# Altium schematic sheet 5_6165557048126742241.SchDoc
size A; SheetNumber: 1; SheetTotal: 1
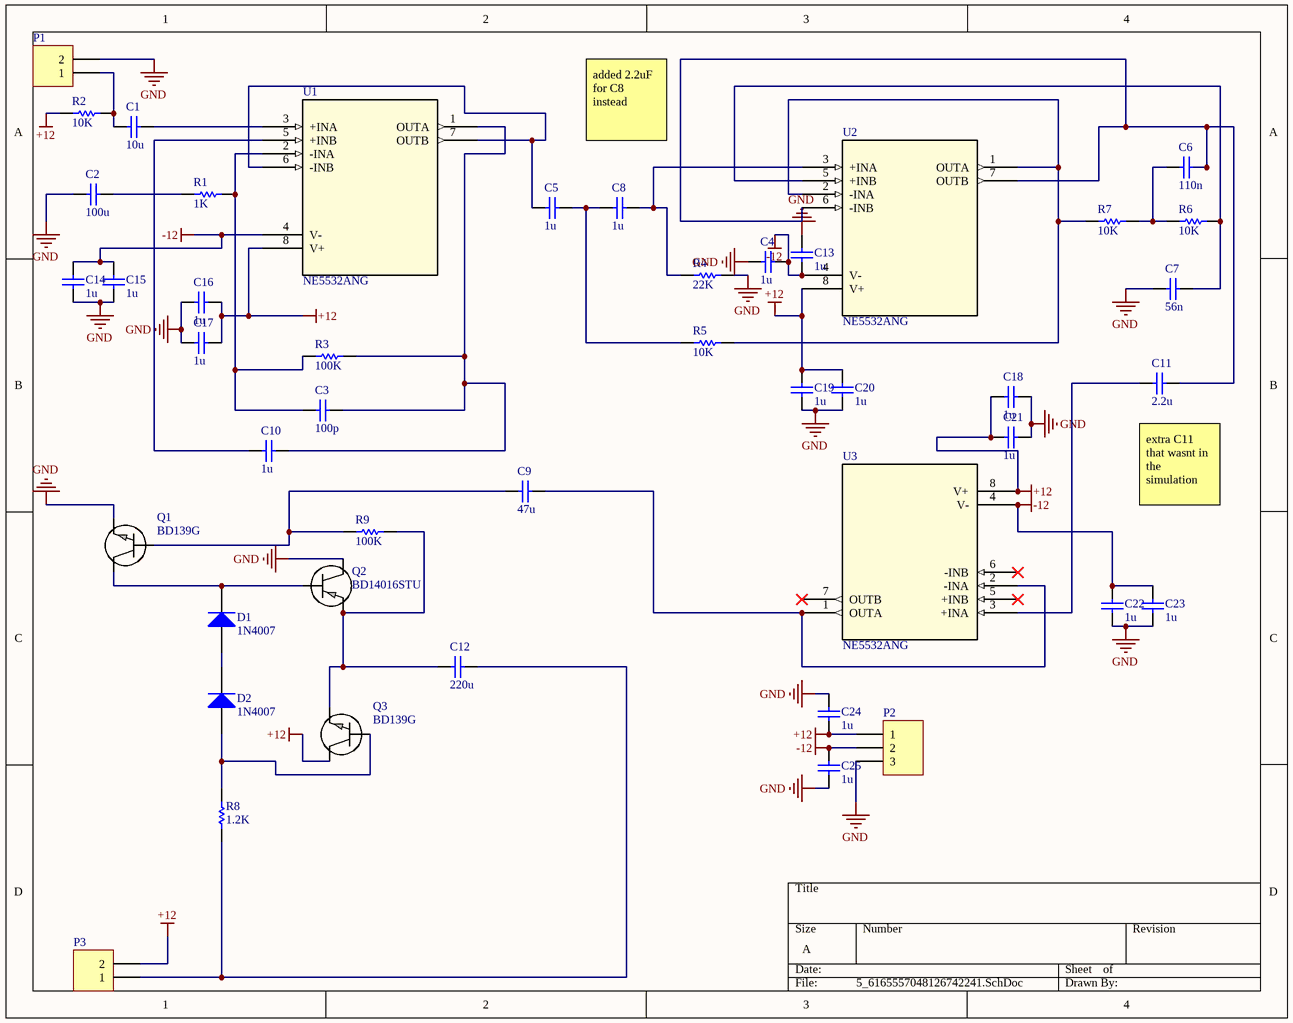
[diagram p0: 5_6165557048126742241.SchDoc]

## Parts
C1  value 10u  [CAP_RDE5C1H104J2K1H03B]  (hidden comment: Capacitor)
C2  value 100u  [CAP_RDE5C1H104J2K1H03B]  (hidden comment: Capacitor)
C3  value 100p  [CAP_RDE5C1H104J2K1H03B]  (hidden comment: Capacitor)
C4  value 1u  [CAP_RDE5C1H104J2K1H03B]  (hidden comment: Capacitor)
C5  value 1u  [CAP_RDE5C1H104J2K1H03B]  (hidden comment: Capacitor)
C6  value 110n  [CAP_RDE5C1H104J2K1H03B]  (hidden comment: Capacitor)
C7  value 56n  [CAP_RDE5C1H104J2K1H03B]  (hidden comment: Capacitor)
C8  value 1u  [CAP_RDE5C1H104J2K1H03B]  (hidden comment: Capacitor)
C9  value 47u  [CAP_RDE5C1H104J2K1H03B]  (hidden comment: Capacitor)
C10  value 1u  [CAP_RDE5C1H104J2K1H03B]  (hidden comment: Capacitor)
C11  value 2.2u  [CAP_RDE5C1H104J2K1H03B]  (hidden comment: Capacitor)
C12  value 220u  [CAP_RDE5C1H104J2K1H03B]  (hidden comment: Capacitor)
C13  value 1u  [CAP_RDE5C1H104J2K1H03B]  (hidden comment: Capacitor)
C14  value 1u  [CAP_RDE5C1H104J2K1H03B]  (hidden comment: Capacitor)
C15  value 1u  [CAP_RDE5C1H104J2K1H03B]  (hidden comment: Capacitor)
C16  value 1u  [CAP_RDE5C1H104J2K1H03B]  (hidden comment: Capacitor)
C17  value 1u  [CAP_RDE5C1H104J2K1H03B]  (hidden comment: Capacitor)
C18  value 1u  [CAP_RDE5C1H104J2K1H03B]  (hidden comment: Capacitor)
C19  value 1u  [CAP_RDE5C1H104J2K1H03B]  (hidden comment: Capacitor)
C20  value 1u  [CAP_RDE5C1H104J2K1H03B]  (hidden comment: Capacitor)
C21  value 1u  [CAP_RDE5C1H104J2K1H03B]  (hidden comment: Capacitor)
C22  value 1u  [CAP_RDE5C1H104J2K1H03B]  (hidden comment: Capacitor)
C23  value 1u  [CAP_RDE5C1H104J2K1H03B]  (hidden comment: Capacitor)
C24  value 1u  [CAP_RDE5C1H104J2K1H03B]  (hidden comment: Capacitor)
C25  value 1u  [CAP_RDE5C1H104J2K1H03B]  (hidden comment: Capacitor)
D1  1N4007  [My_DO41]
D2  1N4007  [My_DO41]
P1  Header 2  [My_1X02]  (value not drawn)
P2  Header 3  [My_CN3]  (value not drawn)
P3  Header 2  [My_1X02]  (value not drawn)
Q1  BD139G  [SOT-32_STM]
Q2  BD14016STU  [SOT-32_STM]
Q3  BD139G  [SOT-32_STM]
R1  value 1K  [RESAD700W45L350D185]  (hidden comment: Resistor)
R2  value 10K  [RESAD700W45L350D185]  (hidden comment: Resistor)
R3  value 100K  [RESAD700W45L350D185]  (hidden comment: Resistor)
R4  value 22K  [RESAD700W45L350D185]  (hidden comment: Resistor)
R5  value 10K  [RESAD700W45L350D185]  (hidden comment: Resistor)
R6  value 10K  [RESAD700W45L350D185]  (hidden comment: Resistor)
R7  value 10K  [RESAD700W45L350D185]  (hidden comment: Resistor)
R8  value 1.2K  [RESAD700W45L350D185]  (hidden comment: Resistor)
R9  value 100K  [RESAD700W45L350D185]  (hidden comment: Resistor)
U1  NE5532ANG  [P8]
U2  NE5532ANG  [P8]
U3  NE5532ANG  [P8]

## Nets
+12: C16.2 C17.2 C18.2 C19.2 C20.2 C21.2 C24.1 P2.1 P3.2 Q3.2(C) R2.1 U1.8(V+) U2.8(V+) U3.8(V+)
-12: C4.1 C13.1 C14.2 C15.2 C22.2 C23.2 C25.2 P2.2 U1.4(V-) U2.4(V-) U3.4(V-)
GND: C2.1 C4.2 C7.1 C13.2 C14.1 C15.1 C16.1 C17.1 C18.1 C19.1 C20.1 C21.1 C22.1 C23.1 C24.2 C25.1 P1.2 P2.3 Q1.1(E) Q2.2(C) R4.2
NetC1_1: C1.1 P1.1 R2.2
NetC1_2: C1.2 U1.3(+INA)
NetC2_2: C2.2 R1.1
NetC3_1: C3.1 R1.2 R3.1 U1.2(-INA)
NetC3_2: C3.2 C10.2 R3.2 U1.1(OUTA)
NetC5_1: C5.1 U1.6(-INB) U1.7(OUTB)
NetC5_2: C5.2 C8.1 R5.1
NetC6_1: C6.1 R6.1 R7.2
NetC6_2: C6.2 C11.2 U2.6(-INB) U2.7(OUTB)
NetC7_2: C7.2 R6.2 U2.5(+INB)
NetC8_2: C8.2 R4.1 U2.3(+INA)
NetC9_1: C9.1 Q1.3(B) R9.1
NetC9_2: C9.2 U3.1(OUTA) U3.2(-INA)
NetC10_1: C10.1 U1.5(+INB)
NetC11_1: C11.1 U3.3(+INA)
NetC12_1: C12.1 Q2.1(E) Q3.1(E) R9.2
NetC12_2: C12.2 P3.1 R8.1
NetD1_A: D1.A D2.K
NetD1_K: D1.K Q1.2(C) Q2.3(B)
NetD2_A: D2.A Q3.3(B) R8.2
NetR5_2: R5.2 R7.1 U2.1(OUTA) U2.2(-INA)

Not connected (* = marked no-connect by the designer): U3 5(+INB)* 6(-INB)* 7(OUTB)*

## Notes on the sheet
- added 2.2uF for C8 instead
- (near C11) extra C11 that wasnt in the simulation

## Library data of the parts
C1-C25 = Capacitor: SimulationGenericComponent: True
D1 D2 = 1N4007: 1 Amp Diode; ASiD Part Number: 1n4007-AS
P1 P3 = Header 2: Header, 2-Pin; ASiD Part Number: Header 2-AS
P2 = Header 3: Header, 3-Pin; ASiD Part Number: Header 3-AS
Q1 Q3 = BD139G: No Description Available; Manufacturer_Name: onsemi; Copyright: Copyright (C) 2026 Ultra Librarian. All rights reserved.; Manufacturer_Part_Number: BD139G
Q2 = BD14016STU: No Description Available; Manufacturer_Name: onsemi; Copyright: Copyright (C) 2026 Ultra Librarian. All rights reserved.; Manufacturer_Part_Number: BD14016STU
R1-R9 = Resistor: TC1: 0; SimulationGenericComponent: True; TC2: 0
U1-U3 = NE5532ANG: No Description Available; Manufacturer_Name: onsemi; Copyright: Copyright (C) 2026 Ultra Librarian. All rights reserved.; Manufacturer_Part_Number: NE5532ANG; RefDes: RefDes; Type: Type